# Altium schematic sheet ПП3.SchDoc
size 209 x 297 mm; SheetNumber: 3; Обозначение: СФ МЭИ ПЭ2-18 11.03.04 03
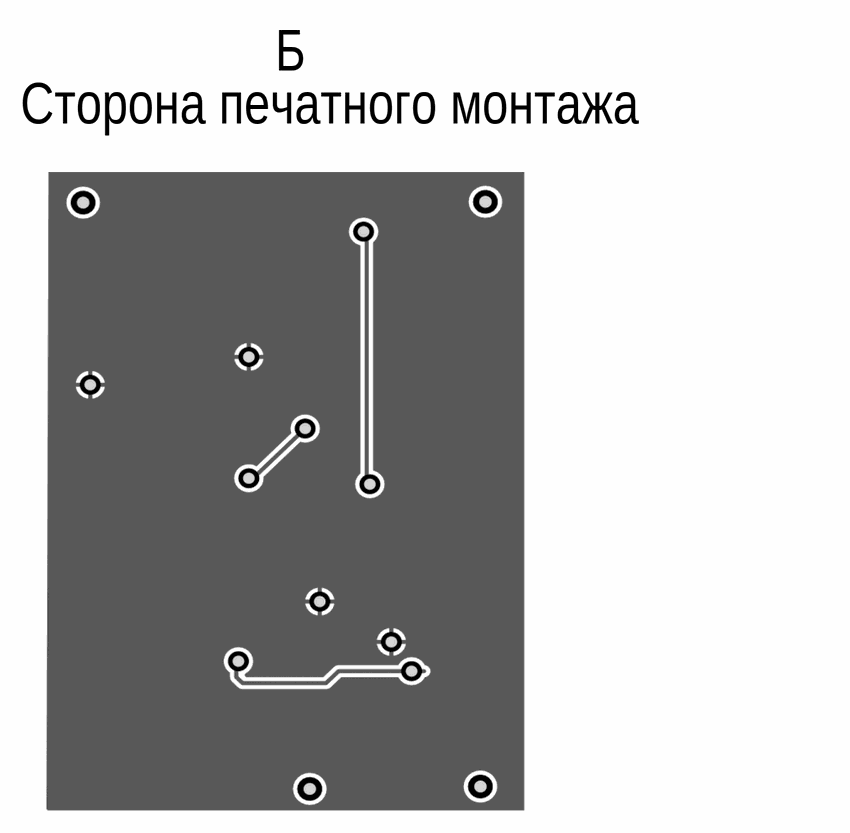
[diagram p0: ПП3.SchDoc]

## Notes on the sheet
- Б
- Сторона печатного монтажа
- Подп. и дата
- Инв. № дубл.
- Взам. инв. №
- Инв. № подл.
- Изм.
- Лист
- № докум.
- Подп.
- Дата
- Копировал
- Формат А4